# Altium schematic sheet HMI_LEDs.SchDoc
size A4; SheetNumber: 14; SheetTotal: 18
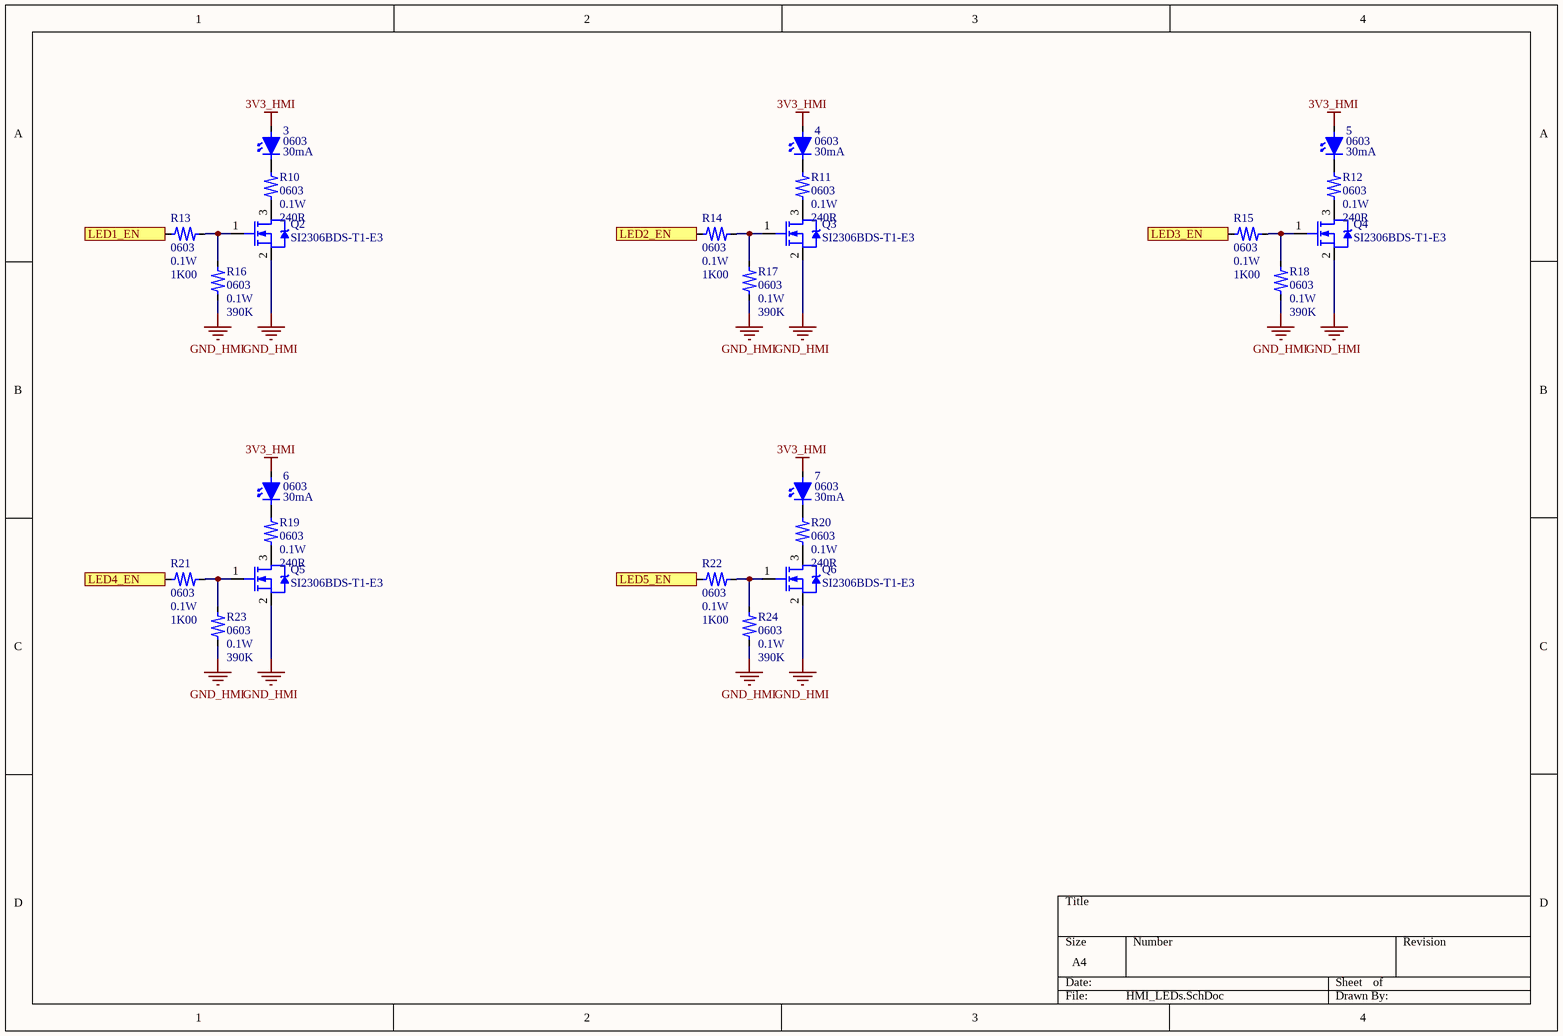
[diagram p0: HMI_LEDs.SchDoc]

## Parts
3  0603  Rating: 30mA  [LED_0603]
4  0603  Rating: 30mA  [LED_0603]
5  0603  Rating: 30mA  [LED_0603]
6  0603  Rating: 30mA  [LED_0603]
7  0603  Rating: 30mA  [LED_0603]
Q2  SI2306BDS-T1-E3  [SOT-23-3]
Q3  SI2306BDS-T1-E3  [SOT-23-3]
Q4  SI2306BDS-T1-E3  [SOT-23-3]
Q5  SI2306BDS-T1-E3  [SOT-23-3]
Q6  SI2306BDS-T1-E3  [SOT-23-3]
R10  0603  value 240R  Rating: 0.1W  [R_0603]
R11  0603  value 240R  Rating: 0.1W  [R_0603]
R12  0603  value 240R  Rating: 0.1W  [R_0603]
R13  0603  value 1K00  Rating: 0.1W  [R_0603]
R14  0603  value 1K00  Rating: 0.1W  [R_0603]
R15  0603  value 1K00  Rating: 0.1W  [R_0603]
R16  0603  value 390K  Rating: 0.1W  [R_0603]
R17  0603  value 390K  Rating: 0.1W  [R_0603]
R18  0603  value 390K  Rating: 0.1W  [R_0603]
R19  0603  value 240R  Rating: 0.1W  [R_0603]
R20  0603  value 240R  Rating: 0.1W  [R_0603]
R21  0603  value 1K00  Rating: 0.1W  [R_0603]
R22  0603  value 1K00  Rating: 0.1W  [R_0603]
R23  0603  value 390K  Rating: 0.1W  [R_0603]
R24  0603  value 390K  Rating: 0.1W  [R_0603]

## Ports
LED1_EN (in), LED2_EN (in), LED3_EN (in), LED4_EN (in), LED5_EN (in)

## Nets
3V3_HMI: 3.2(DA) 4.2(DA) 5.2(DA) 6.2(DA) 7.2(DA)
GND_HMI: Q2.2(S) Q3.2(S) Q4.2(S) Q5.2(S) Q6.2(S) R16.1(R1) R17.1(R1) R18.1(R1) R23.1(R1) R24.1(R1)
LED1_EN: R13.1(R1) ; port LED1_EN
LED2_EN: R14.1(R1) ; port LED2_EN
LED3_EN: R15.1(R1) ; port LED3_EN
LED4_EN: R21.1(R1) ; port LED4_EN
LED5_EN: R22.1(R1) ; port LED5_EN
Net3_1: 3.1(DC) R10.2(R2)
Net4_1: 4.1(DC) R11.2(R2)
Net5_1: 5.1(DC) R12.2(R2)
Net6_1: 6.1(DC) R19.2(R2)
Net7_1: 7.1(DC) R20.2(R2)
NetQ2_1: Q2.1(G) R13.2(R2) R16.2(R2)
NetQ2_3: Q2.3(D) R10.1(R1)
NetQ3_1: Q3.1(G) R14.2(R2) R17.2(R2)
NetQ3_3: Q3.3(D) R11.1(R1)
NetQ4_1: Q4.1(G) R15.2(R2) R18.2(R2)
NetQ4_3: Q4.3(D) R12.1(R1)
NetQ5_1: Q5.1(G) R21.2(R2) R23.2(R2)
NetQ5_3: Q5.3(D) R19.1(R1)
NetQ6_1: Q6.1(G) R22.2(R2) R24.2(R2)
NetQ6_3: Q6.3(D) R20.1(R1)

## Library data of the parts
3-7 = Opt_FYLS-0603UGC_LED_0603_Green_30mA_Diode_LED: Note: 40mcd; Tolerance: 5%; Distributor: Lomex; Link: http://lomex.hu/hu/webshop/#/page,0/stype,1/sidx,10/instock,0/search,95-03-08; Order Number: 95-03-08; Package: 0603; Part Number: FYLS-0603UGC; Price (HUF): 10; Type: LED; ID: Opt_FYLS-0603UGC_LED_0603_Green_30mA_Diode_LED
Q2-Q6 = SI2306BDS-T1-E3: N-Channel Power MOSFET; ID: Tra_SOT-23-3_30V_4A_N-FET; Rating: 4A; Type: N-FET; Value: 30V; Distributor: Lomex; Link: http://lomex.hu/hu/webshop/#/page,0/stype,1/sidx,10/instock,0/search,86-01-57; Order number: 86-01-57; Package: SOT-23-3; Part Number: SI2306BDS-T1-E3; Price (HUF): 83; NI part number: -; NI PEN/DEB: -
R10-R12 R19 R20 = CR-03JL7--240R: NI part number: 612640-01; Tolerance: 5%; Note: NI: not in stock; ID: Res_0603_240R_0.1W_Chip; NI PEN/DEB: DEB; Type: Chip Resistor; Part Number: CR-03JL7--240R; Order Number: 81-12-26; Distributor: Lomex; Link: http://lomex.hu/hu/webshop/#/page,0/search,81-12-26/stype,1/sidx,1; Price (HUF): 0.80; Package: 0603
R13-R15 R21 R22 = CR-03FL7----1K: NI part number: 713776-01; Tolerance: 1%; ID: Res_0603_1K00_0.1W_Chip; NI PEN/DEB: DEB; Type: Chip Resistor; Part Number: CR-03FL7----1K; Order Number: 80-11-59; Distributor: Lomex; Link: http://lomex.hu/hu/webshop/#/page,0/search,80-11-59/stype,1/sidx,1; Price (HUF): 0.80; Package: 0603
R16-R18 R23 R24 = CR-03FL7--390K: Tolerance: 1%; ID: Res_0603_390K_0.1W_Chip; Type: Chip Resistor; Part Number: CR-03FL7--390K; Order Number: 80-13-26; Distributor: Lomex; Link: http://lomex.hu/hu/webshop/#/page,0/search,80-13-26/stype,1/sidx,1; Price (HUF): 0.80; Package: 0603; NI part number: -; NI PEN/DEB: -